# Altium schematic sheet 726386-21_726386-2.schdoc
size 124 x 101 mm
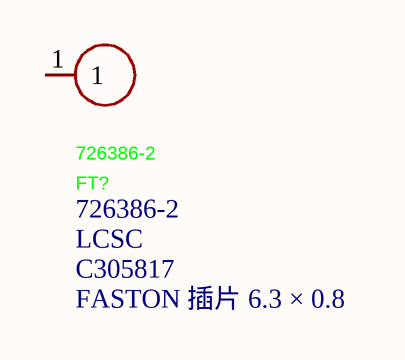
[diagram p0: 726386-21_726386-2.schdoc]

## Parts
FT?  726386-2  LCSC Part Name: FASTON 插片 6.3 × 0.8  Supplier Part: C305817  Supplier: LCSC  [CONN-TH_726386-2]

## Nets

Not connected (* = marked no-connect by the designer): FT? 1

## Library data of the parts
FT? = 726386-2: Manufacturer: TE Connectivity(泰科电子); Add into BOM: yes; Symbol: 726386-2; Device: 726386-2; Manufacturer Part: 726386-2; Supplier Footprint: 插件; JLCPCB Part Class: Extended Part; Datasheet: https://item.szlcsc.com/datasheet/726386-2/289903.html; Convert to PCB: yes